# Altium schematic sheet BANK115-116-117-118.SchDoc
size A4
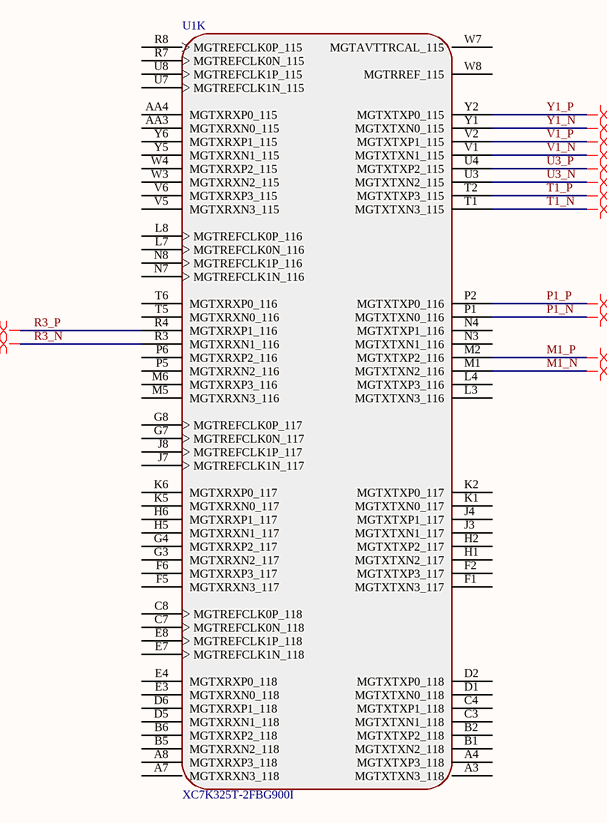
[diagram p0: BANK115-116-117-118.SchDoc]

## Parts
U1  XC7K325T-2FBG900I  (part K of 17)

## Nets
M1_N: U1.M1(MGTXTXN2_116)
M1_P: U1.M2(MGTXTXP2_116)
P1_N: U1.P1(MGTXTXN0_116)
P1_P: U1.P2(MGTXTXP0_116)
R3_N: U1.R3(MGTXRXN1_116)
R3_P: U1.R4(MGTXRXP1_116)
T1_N: U1.T1(MGTXTXN3_115)
T1_P: U1.T2(MGTXTXP3_115)
U3_N: U1.U3(MGTXTXN2_115)
U3_P: U1.U4(MGTXTXP2_115)
V1_N: U1.V1(MGTXTXN1_115)
V1_P: U1.V2(MGTXTXP1_115)
Y1_N: U1.Y1(MGTXTXN0_115)
Y1_P: U1.Y2(MGTXTXP0_115)

Not connected (* = marked no-connect by the designer): U1 A3(MGTXTXN3_118) A4(MGTXTXP3_118) A7(MGTXRXN3_118) A8(MGTXRXP3_118) AA3(MGTXRXN0_115) AA4(MGTXRXP0_115) B1(MGTXTXN2_118) B2(MGTXTXP2_118) B5(MGTXRXN2_118) B6(MGTXRXP2_118) C3(MGTXTXN1_118) C4(MGTXTXP1_118) C7(MGTREFCLK0N_118) C8(MGTREFCLK0P_118) D1(MGTXTXN0_118) D2(MGTXTXP0_118) D5(MGTXRXN1_118) D6(MGTXRXP1_118) E3(MGTXRXN0_118) E4(MGTXRXP0_118) E7(MGTREFCLK1N_118) E8(MGTREFCLK1P_118) F1(MGTXTXN3_117) F2(MGTXTXP3_117) F5(MGTXRXN3_117) F6(MGTXRXP3_117) G3(MGTXRXN2_117) G4(MGTXRXP2_117) G7(MGTREFCLK0N_117) G8(MGTREFCLK0P_117) H1(MGTXTXN2_117) H2(MGTXTXP2_117) H5(MGTXRXN1_117) H6(MGTXRXP1_117) J3(MGTXTXN1_117) J4(MGTXTXP1_117) J7(MGTREFCLK1N_117) J8(MGTREFCLK1P_117) K1(MGTXTXN0_117) K2(MGTXTXP0_117) K5(MGTXRXN0_117) K6(MGTXRXP0_117) L3(MGTXTXN3_116) L4(MGTXTXP3_116) L7(MGTREFCLK0N_116) L8(MGTREFCLK0P_116) M5(MGTXRXN3_116) M6(MGTXRXP3_116) N3(MGTXTXN1_116) N4(MGTXTXP1_116) N7(MGTREFCLK1N_116) N8(MGTREFCLK1P_116) P5(MGTXRXN2_116) P6(MGTXRXP2_116) R7(MGTREFCLK0N_115) R8(MGTREFCLK0P_115) T5(MGTXRXN0_116) T6(MGTXRXP0_116) U7(MGTREFCLK1N_115) U8(MGTREFCLK1P_115) V5(MGTXRXN3_115) V6(MGTXRXP3_115) W3(MGTXRXN2_115) W4(MGTXRXP2_115) W7(MGTAVTTRCAL_115) W8(MGTRREF_115) Y5(MGTXRXN1_115) Y6(MGTXRXP1_115)

## Layout directives
differential pair: M1_N, M1_P, P1_N, P1_P, R3_N, R3_P, T1_N, T1_P, U3_N, U3_P, V1_N, V1_P, Y1_N, Y1_P